# EAGLE design arduino-ss-usbmod-zif-smaller (EAGLE 7.7.0)
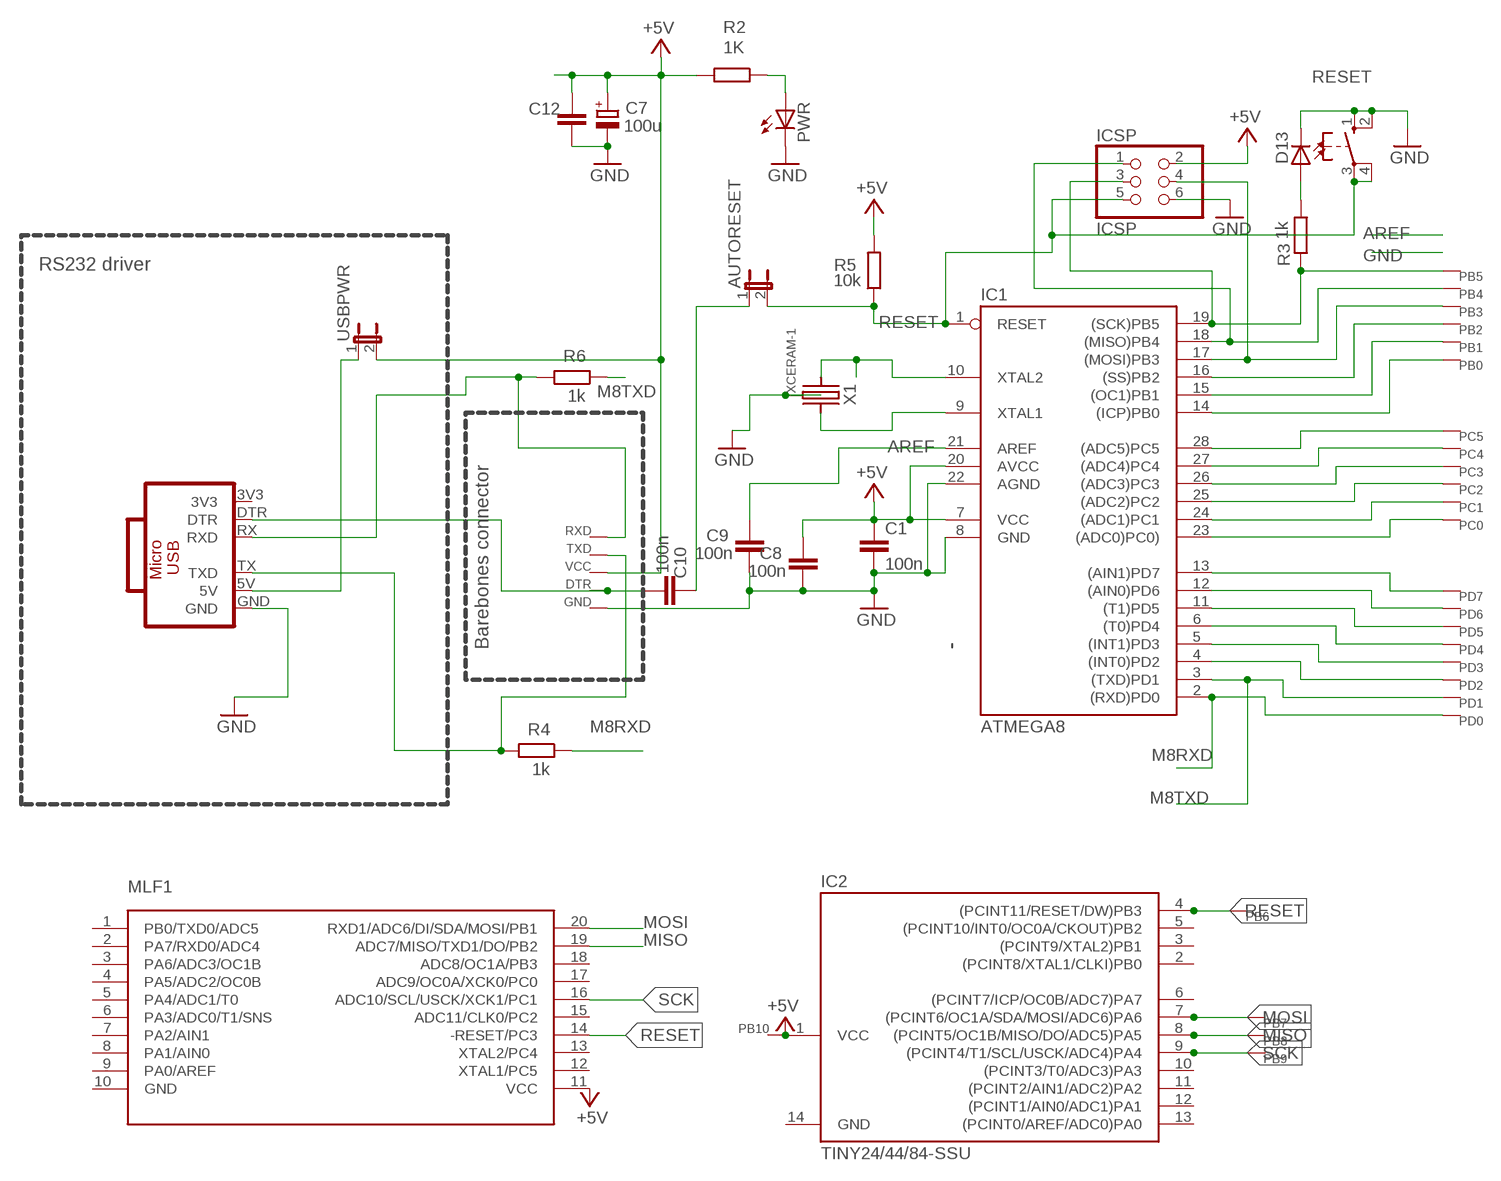
[diagram p0: schematic, sheet 1]

## Parts
AUTORESET  JUMPER-2PTH  [1X02]
C1  100n  C-EU050-025X075  [C050-025X075]
C7  100u  CPOL-EUE3.5-8  [E3,5-8]
C8  100n  C-EU050-025X075  [C050-025X075]
C9  100n  C-EU050-025X075  [C050-025X075]
C10  100n  C-EU050-025X075  [C050-025X075]
C12  100n  C-EU050-025X075  [C050-025X075]
D13  LED3MM  [LED3MM]
DTR  WIRER  [GENERIC-RD-1]
GND  WIRER  [GENERIC-RD-1]
IC1  ATMEGA8  AT90S4433ZIF  [ZIF28/3]
IC2  TINY24/44/84-SSU  [SOIC14]
ICSP  ICSP  PINHD-2X3  [2X03]
MLF1  ATTINY1634SOIC20  [SOIC20]
MOD1  CH340E-MODNOHOLES  [CH340E-MOD-NOHOLES]
PB0  WIRE-VIA11  [VIA11]
PB1  WIRE-VIA11  [VIA11]
PB2  WIRE-VIA11  [VIA11]
PB3  WIRE-VIA11  [VIA11]
PB4  WIRE-VIA11  [VIA11]
PB5  WIRE-VIA11  [VIA11]
PB6  WIRE-VIA11  [VIA11]
PB7  WIRE-VIA11  [VIA11]
PB8  WIRE-VIA11  [VIA11]
PB9  WIRE-VIA11  [VIA11]
PB10  WIRE-VIA11  [VIA11]
PC0  WIRER  [GENERIC-RD-1]
PC1  WIRE-VIA11  [VIA11]
PC2  WIRE-VIA11  [VIA11]
PC3  WIRE-VIA11  [VIA11]
PC4  WIRE-VIA11  [VIA11]
PC5  WIRE-VIA11  [VIA11]
PD0  WIRE-VIA11  [VIA11]
PD1  WIRE-VIA11  [VIA11]
PD2  WIRE-VIA11  [VIA11]
PD3  WIRE-VIA11  [VIA11]
PD4  WIRE-VIA11  [VIA11]
PD5  WIRE-VIA11  [VIA11]
PD6  WIRE-VIA11  [VIA11]
PD7  WIRE-VIA11  [VIA11]
PWR  LED3MM  [LED3MM]
R2  1K  R-EU_0207/7  [0207/7]
R3  1k  R-EU_0204/5  [0204/5]
R4  1k  R-EU_0207/7  [0207/7]
R5  10k  R-EU_0207/7  [0207/7]
R6  1k  R-EU_0207/7  [0207/7]
RESET  10-XX  [B3F-10XX]
RXD  WIRER  [GENERIC-RD-1]
TXD  WIRER  [GENERIC-RD-1]
USBPWR  JUMPER-2PTH  [1X02]
VCC  WIRE-VIA11  [VIA11]
X1  XCERAM-1  [XTAL-3]

## Nets
+5V [power]: C1.1 C7.+ C8.2 C12.2 IC1.7(VCC) IC1.20(AVCC) IC2.1(VCC) ICSP.2 MLF1.11(VCC) PB10.P$1 R2.2 R5.2 USBPWR.2 VCC.P$1
AREF: C9.2 IC1.21(AREF)
DTR: C10.1 DTR.P$1 MOD1.DTR
GND [power]: C1.2 C7.- C8.1 C9.1 C12.1 D13.K(C) GND.P$1 IC1.8(GND) IC1.22(AGND) ICSP.6 MOD1.GND PWR.K(C) RESET.1(S) RESET.2(S1) X1.P$2(GND)
M8RXD: IC1.2((RXD)PD0) PD0.P$1 R4.1
M8TXD: IC1.3((TXD)PD1) PD1.P$1 R6.1
MISO: IC1.18((MISO)PB4) IC2.8((PCINT5/OC1B/MISO/DO/ADC5)PA5) ICSP.1 MLF1.19(ADC7/MISO/TXD1/DO/PB2) PB4.P$1 PB8.P$1
MOSI: IC1.17((MOSI)PB3) IC2.7((PCINT6/OC1A/SDA/MOSI/ADC6)PA6) ICSP.4 MLF1.20(RXD1/ADC6/DI/SDA/MOSI/PB1) PB3.P$1 PB7.P$1
N$1: D13.A R3.1
N$2 [power]: MOD1.5V USBPWR.1
N$3: PWR.A R2.1
N$4: AUTORESET.1 C10.2
N$5: IC1.14((ICP)PB0) PB0.P$1
N$6: IC1.9(XTAL1) X1.P$3
N$7: IC1.10(XTAL2) X1.P$1
N$10: IC1.4((INT0)PD2) PD2.P$1
N$11: IC1.5((INT1)PD3) PD3.P$1
N$12: IC1.6((T0)PD4) PD4.P$1
N$13: IC1.11((T1)PD5) PD5.P$1
N$14: IC1.12((AIN0)PD6) PD6.P$1
N$15: IC1.13((AIN1)PD7) PD7.P$1
N$16: IC1.23((ADC0)PC0)) PC0.P$1
N$17: IC1.24((ADC1)PC1) PC1.P$1
N$18: IC1.25((ADC2)PC2) PC2.P$1
N$19: IC1.26((ADC3)PC3) PC3.P$1
N$20: IC1.27((ADC4)PC4) PC4.P$1
N$21: IC1.28((ADC5)PC5) PC5.P$1
N$22: IC1.15((OC1)PB1) PB1.P$1
N$26: MOD1.TX(TXD) R4.2 TXD.P$1
N$27: MOD1.RX(RXD) R6.2 RXD.P$1
RESET: AUTORESET.2 IC1.1(RESET) IC2.4((PCINT11/RESET/DW)PB3) ICSP.5 MLF1.14(-RESET/PC3) PB6.P$1 R5.1 RESET.3(P) RESET.4(P1)
SCK: IC1.19((SCK)PB5) IC2.9((PCINT4/T1/SCL/USCK/ADC4)PA4) ICSP.3 MLF1.16(ADC10/SCL/USCK/XCK1/PC1) PB5.P$1 PB9.P$1 R3.2
SS: IC1.16((SS)PB2) PB2.P$1
Unconnected: IC2.2((PCINT8/XTAL1/CLKI)PB0) IC2.3((PCINT9/XTAL2)PB1) IC2.5((PCINT10/INT0/OC0A/CKOUT)PB2) IC2.6((PCINT7/ICP/OC0B/ADC7)PA7) IC2.10((PCINT3/T0/ADC3)PA3) IC2.11((PCINT2/AIN1/ADC2)PA2) IC2.12((PCINT1/AIN0/ADC1)PA1) IC2.13((PCINT0/AREF/ADC0)PA0) MLF1.1(PB0/TXD0/ADC5) MLF1.2(PA7/RXD0/ADC4) MLF1.3(PA6/ADC3/OC1B) MLF1.4(PA5/ADC2/OC0B) MLF1.5(PA4/ADC1/T0) MLF1.6(PA3/ADC0/T1/SNS) MLF1.7(PA2/AIN1) MLF1.8(PA1/AIN0) MLF1.9(PA0/AREF) MLF1.12(XTAL1/PC5) MLF1.13(XTAL2/PC4) MLF1.15(ADC11/CLK0/PC2) MLF1.17(ADC9/OC0A/XCK0/PC0) MLF1.18(ADC8/OC1A/PB3)

## Notes on the sheet
- RS232 driver
- Barebones connector

## Power pins joined to a net without a drawn wire
3V3: MOD1.3V3
GND: IC2.14(GND) MLF1.10(GND)

## Library data of the parts
AUTORESET USBPWR = SparkFun:JUMPER-2: Jumper Basic 0.1" spaced jumper. Use with breakaway headers.
C1 C8-C10 C12 = my-rcl:C-EU: CAPACITOR, European symbol
C7 = my-rcl:CPOL-EU: POLARIZED CAPACITOR, European symbol
D13 PWR = led:LED: LED OSRAM: - CHIPLED LG R971, LG N971, LY N971, LG Q971, LY Q971, LO R971, LY R971 LH N974, LH R974 LS Q976, LO Q976, LY Q976 LO Q996 - Hyper CHIPLED LW Q18S LB Q993, LB Q99A, LB R99A - SideLED LS A670, LO A670, LY A670, LG A670, LP A670 LB A673, LV A673, LT A673, LW A673 LH A674 LY A675 LS A676, LA A676, LO A676, LY A676, LW A676 LS A679, LY A679, LG A679 - Hyper Micro SIDELED® LS Y876, LA Y876, LO Y876, LY Y876 LT Y87S - SmartLED LW L88C, LW L88S LB L89C, LB L89S, LG L890 LS L89K, LO L89K, LY L89K LS L896, LA L896, LO L896, LY L896 - TOPLED LS T670, LO T670, LY T670, LG T670, LP T670 LSG T670, LSP T670, LSY T670, LOP T670, LYG T670 LG T671, LOG T671, LSG T671 LB T673, LV T673, LT T673, LW T673 LH T674 LS T676, LA T676, LO T676, LY T676, LB T676, LH T676, LSB T676, LW T676 LB T67C, LV T67C, LT T67C, LS T67K, LO T67K, LY T67K, LW E67C LS E67B, LA E67B, LO E67B, LY E67B, LB E67C, LV E67C, LT E67C LW T67C LS T679, LY T679, LG T679 LS T770, LO T770, LY T770, LG T770, LP T770 LB T773, LV T773, LT T773, LW T773 LH T774 LS E675, LA E675, LY E675, LS T675 LS T776, LA T776, LO T776, LY T776, LB T776 LHGB T686 LT T68C, LB T68C - Hyper Mini TOPLED® LB M676 - Mini TOPLED Santana® LG M470 LS M47K, LO M47K, LY M47K Source: http://www.osram.convergy.de/
DTR GND PB0 PB1-PB10 PC0 PC1-PC5 PD0 PD1-PD7 RXD TXD VCC = mylib4:WIRE: Pad for a wire offboard
IC1 = atmel:AT90S4433: MICROCONTROLLER 4 Kbytes FLASH 128 bytes SRAM 256 bytes EEPROM UART 6-channel 10 bit ADC
IC2 = avr-7:TINY24/44/84
ICSP = pinhead:PINHD-2X3: PIN HEADER
MLF1 = attiny1634:ATTINY1634
MOD1 = mini-usb:CH340E-MOD
R2-R6 = my-rcl:R-EU_: RESISTOR, European symbol
RESET = switch-omron:10-XX: OMRON SWITCH
X1 = mylib4:XCERAM: Ceramic resonator with built-in caps

## Net classes
0 default: width 0.5 mm
1 power: width 0.6 mm

## Board
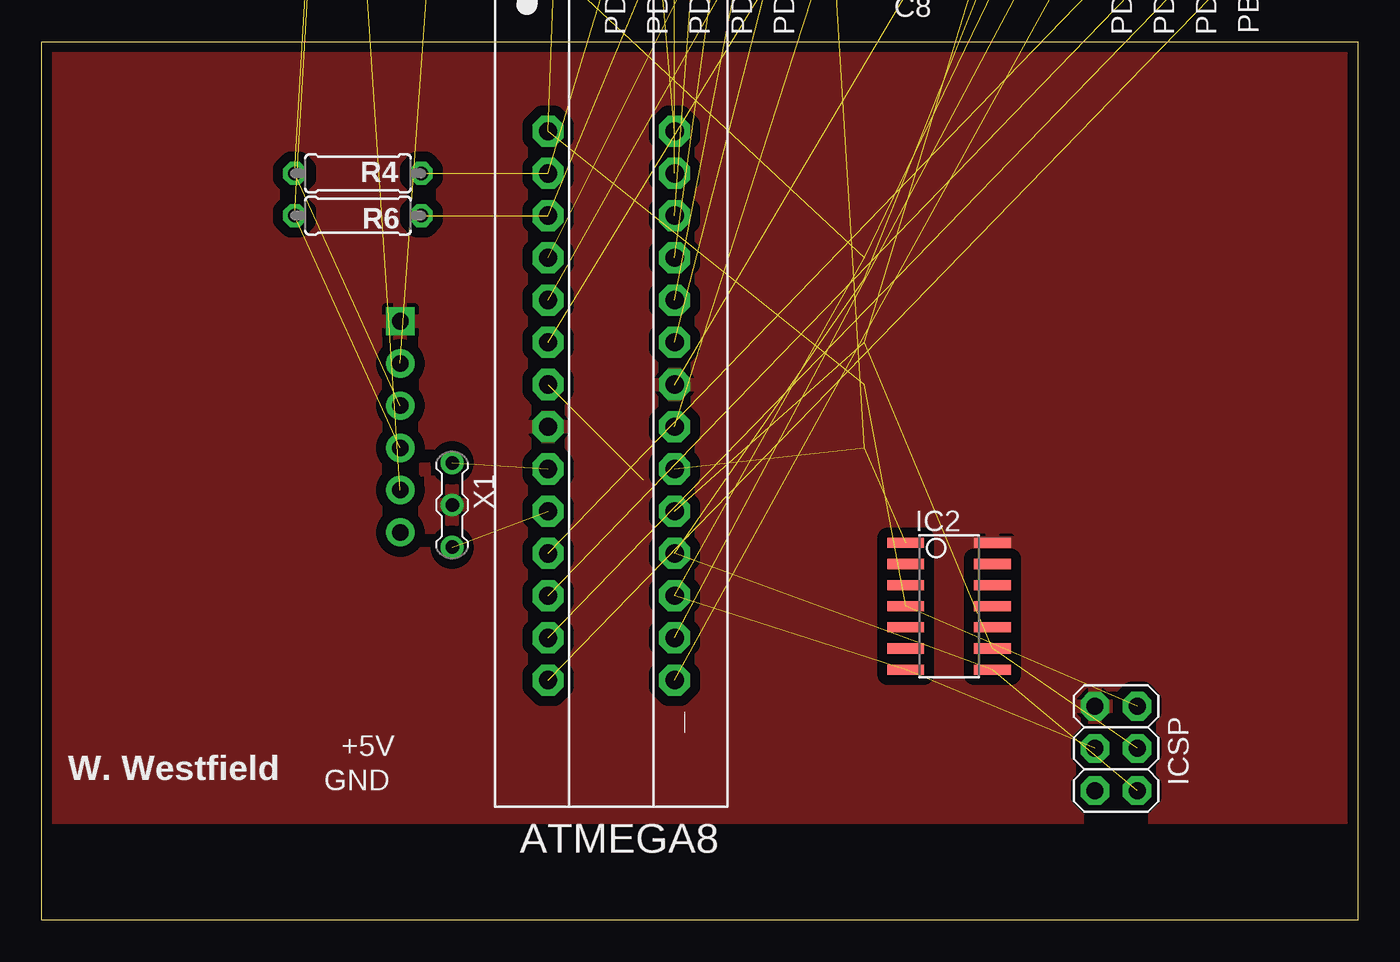
[diagram p1: board, top side]
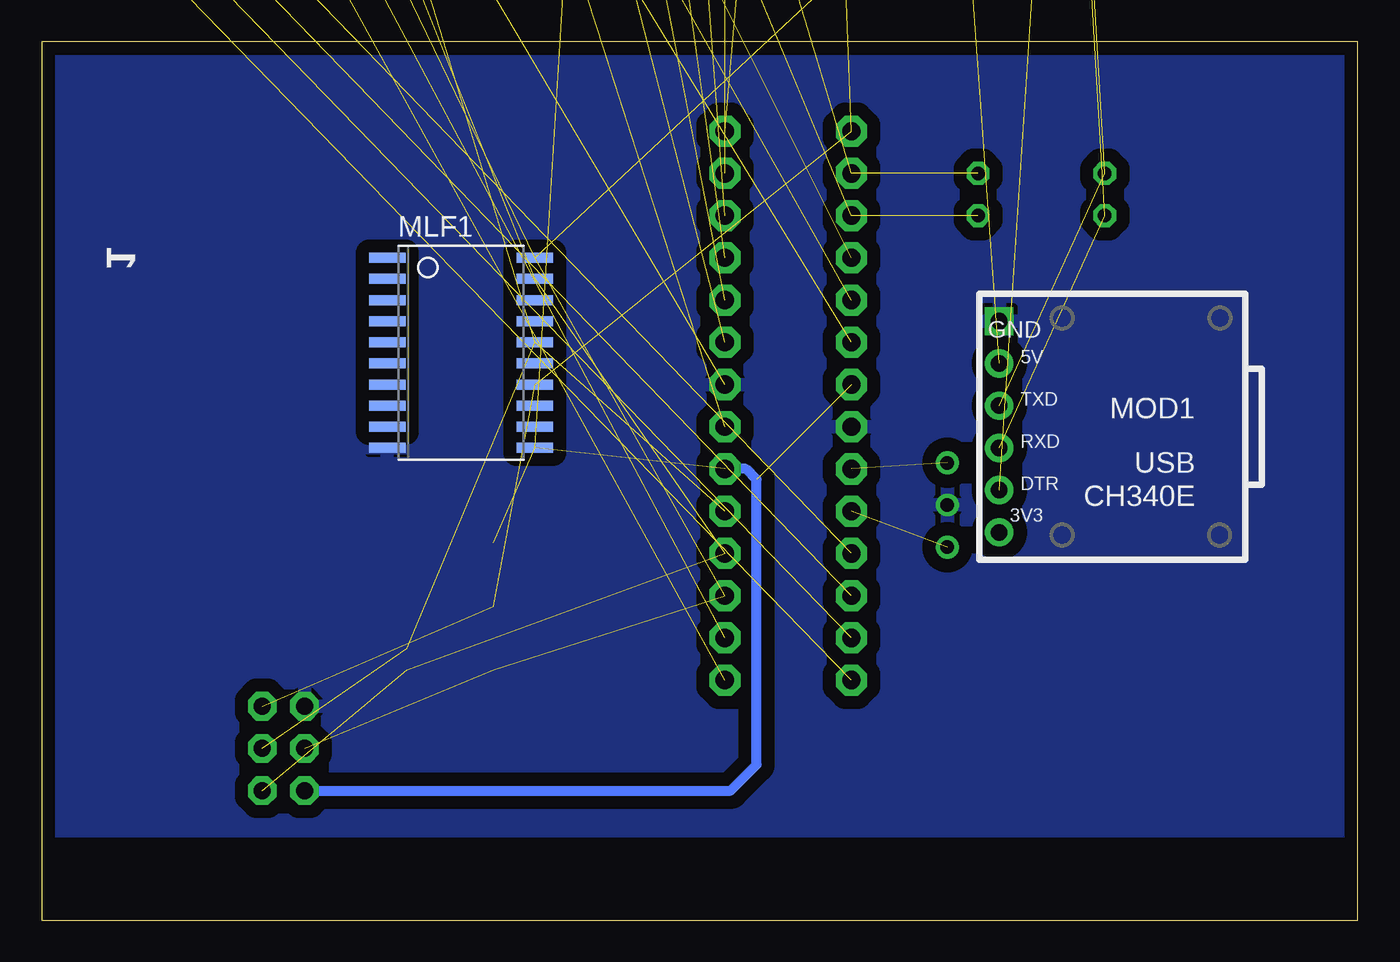
[diagram p2: board, bottom side, seen from below]

Size 79.21 x 52.86 mm. Coordinates in mm from the lower left corner, seen from the top.
Outline: 0,0 0,52.86 79.21,52.86 79.21,0 0,0
Copper layers (1*16): Top 0.035mm / dielectric 1.5mm / Bottom 0.035mm
Design rules "default *": minimum track width 10mil, minimum drill 0.8mm, track to track 0.35mm, track to pad 0.35mm, pad to pad 0.35mm, via to via 8mil, smd to smd 8mil, copper to edge 20mil, drill to drill 8mil, minimum pad ring 5mil, minimum via ring 8mil, stop-mask expansion 4mil, vias tented up to drill 0mil, thermal gap 10mil

### Footprints (pad centres in the part's own frame; a part is rotated, then mirrored left to right if it is on the bottom)
1X02 = drill 1.016: 1 0,0; 2 2.54,0
C050-025X075 = drill 0.813 octagon: 1 -2.54,0; 2 2.54,0
E3,5-8 = drill 0.813 pad 1.6: + -1.778,0 | drill 0.813 pad 1.6 octagon: - 1.778,0
LED3MM = drill 0.813 octagon: A -1.27,0; K 1.27,0
GENERIC-RD-1 = drill 0.813: P$1 0,0
ZIF28/3 = drill 1.1 pad 1.6 octagon: 1 -16.51,-3.81; 2 -13.97,-3.81; 3 -11.43,-3.81; 4 -8.89,-3.81; 5 -6.35,-3.81; 6 -3.81,-3.81; 7 -1.27,-3.81; 8 1.27,-3.81; 9 3.81,-3.81; 10 6.35,-3.81; 11 8.89,-3.81; 12 11.43,-3.81; 13 13.97,-3.81; 14 16.51,-3.81; 15 16.51,3.81; 16 13.97,3.81; 17 11.43,3.81; 18 8.89,3.81; 19 6.35,3.81; 20 3.81,3.81; 21 1.27,3.81; 22 -1.27,3.81; 23 -3.81,3.81; 24 -6.35,3.81; 25 -8.89,3.81; 26 -11.43,3.81; 27 -13.97,3.81; 28 -16.51,3.81
SOIC14 = smd 0.61 x 2.21: 1 -3.81,-2.603; 2 -2.54,-2.603; 3 -1.27,-2.603; 4 0,-2.603; 5 1.27,-2.603; 6 2.54,-2.603; 7 3.81,-2.603; 8 3.81,2.603; 9 2.54,2.603; 10 1.27,2.603; 11 0,2.603; 12 -1.27,2.603; 13 -2.54,2.603; 14 -3.81,2.603
2X03 = drill 1.016 octagon: 1 -2.54,-1.27; 2 -2.54,1.27; 3 0,-1.27; 4 0,1.27; 5 2.54,-1.27; 6 2.54,1.27
SOIC20 = smd 0.6 x 2.2: 1 -1.905,-4.445; 2 -0.635,-4.445; 3 0.635,-4.445; 4 1.905,-4.445; 5 3.175,-4.445; 6 4.445,-4.445; 7 5.715,-4.445; 8 6.985,-4.445; 9 8.255,-4.445; 10 9.525,-4.445; 11 9.525,4.445; 12 8.255,4.445; 13 6.985,4.445; 14 5.715,4.445; 15 4.445,4.445; 16 3.175,4.445; 17 1.905,4.445; 18 0.635,4.445; 19 -0.635,4.445; 20 -1.905,4.445
CH340E-MOD-NOHOLES = drill 1: 3V3 6.35,6.35; 5V 6.35,-3.81; DTR 6.35,3.81; RX 6.35,1.27; TX 6.35,-1.27 | drill 1 square: GND 6.35,-6.35
VIA11 = drill 1.1: P$1 0,0
0207/7 = drill 0.813 octagon: 1 -3.81,0; 2 3.81,0
0204/5 = drill 0.813 octagon: 1 -2.54,0; 2 2.54,0
B3F-10XX = drill 1.016 long: 1 -3.251,2.261; 2 3.251,2.261; 3 -3.251,-2.261; 4 3.251,-2.261
XTAL-3 = drill 0.813: P$1 0,2.54; P$2 0,0; P$3 0,-2.54

### Placement (x,y rotation side)
AUTORESET  29.07,77.14 0 top  (outside the outline)
C1  50.96,80.62 180 top  (outside the outline)
C7  41.55,89.23 270 top  (outside the outline)
C8  50.27,57.09 180 top  (outside the outline)
C9  50.84,77.44 0 top  (outside the outline)
C10  31.74,83.1 270 top  (outside the outline)
C12  35.83,91.14 90 top  (outside the outline)
D13  62.87,81.97 0 top  (outside the outline)
DTR  17.77,83.03 180 top  (outside the outline)
GND  17.77,93.19 180 top  (outside the outline)
IC1  34.28,30.96 270 top
IC2  54.6,18.89 270 top
ICSP  64.66,10.34 90 top
MLF1  53.97,37.94 270 bottom
MOD1  15.23,29.69 180 bottom
PB0  72.38,57.63 270 top  (outside the outline)
PB1  72.38,76.68 90 top  (outside the outline)
PB2  69.84,76.68 90 top  (outside the outline)
PB3  67.3,76.68 90 top  (outside the outline)
PB4  64.76,76.68 90 top  (outside the outline)
PB5  62.22,76.68 90 top  (outside the outline)
PB6  9.52,74.77 0 top  (outside the outline)
PB7  12.06,74.77 0 top  (outside the outline)
PB8  14.6,74.77 0 top  (outside the outline)
PB9  17.14,74.77 0 top  (outside the outline)
PB10  19.68,74.77 0 top  (outside the outline)
PC0  48.25,74.14 0 top  (outside the outline)
PC1  45.71,76.68 0 top  (outside the outline)
PC2  43.17,76.68 90 top  (outside the outline)
PC3  40.63,76.68 90 top  (outside the outline)
PC4  38.09,76.68 90 top  (outside the outline)
PC5  35.55,76.68 90 top  (outside the outline)
PD0  34.28,57.63 270 top  (outside the outline)
PD1  36.82,57.63 270 top  (outside the outline)
PD2  39.36,57.63 270 top  (outside the outline)
PD3  41.9,57.63 270 top  (outside the outline)
PD4  44.44,57.63 270 top  (outside the outline)
PD5  64.76,57.63 270 top  (outside the outline)
PD6  67.3,57.63 270 top  (outside the outline)
PD7  69.84,57.63 270 top  (outside the outline)
PWR  41.18,82.7 180 top  (outside the outline)
R2  49.2,89.49 90 top  (outside the outline)
R3  58.48,80.21 270 top  (outside the outline)
R4  19.04,44.93 180 top
R5  69.07,89.14 270 top  (outside the outline)
R6  19.04,42.39 180 top
RESET  57.56,89.19 180 top  (outside the outline)
RXD  17.77,85.57 180 top  (outside the outline)
TXD  17.77,88.11 180 top  (outside the outline)
USBPWR  25.87,93.42 0 top  (outside the outline)
VCC  31.07,93.74 0 top  (outside the outline)
X1  24.7,24.98 180 top

### Tracks (layer width: path | path; a pad name or v marks a point on that pad's centre or on a via)
+5V  (12 unrouted)
  Bottom 0.6: ICSP.2 37.75,7.8 36.19,9.37 36.19,26.51 36.82,27.15 IC1.20
AREF  (1 unrouted)
DTR  (2 unrouted)
GND  (10 unrouted)
  pour Bottom (isolate 0.8, rank 6): -3.18,54.33 80.8,54.33 80.8,5.4 -3.18,5.4
  pour Top (isolate 0.61): -1.28,54.45 -1.28,6.19 81.27,6.19 81.27,54.45
M8RXD  (2 unrouted)
M8TXD  (2 unrouted)
MISO  (5 unrouted)
MOSI  (5 unrouted)
N$1  (1 unrouted)
N$2  (1 unrouted)
N$3  (1 unrouted)
N$4  (1 unrouted)
N$5  (1 unrouted)
N$6  (1 unrouted)
N$7  (1 unrouted)
N$9  (via drill 1.2)
  other vias: 7.64,93.36
N$10  (1 unrouted)
N$11  (1 unrouted)
N$12  (1 unrouted)
N$13  (1 unrouted)
N$14  (1 unrouted)
N$15  (1 unrouted)
N$16  (1 unrouted)
N$17  (1 unrouted)
N$18  (1 unrouted)
N$19  (1 unrouted)
N$20  (1 unrouted)
N$21  (1 unrouted)
N$22  (1 unrouted)
N$23  (via drill 1.2)
  other vias: 7.67,80.35
N$26  (2 unrouted)
N$27  (2 unrouted)
RESET  (8 unrouted)
SCK  (6 unrouted)
SS  (1 unrouted)

### Text on the board
bPlace: 1
tNames: +5V | W. Westfield | GND
_tSilk: USBPWR | GND | RESET | 100u | 10k | C7 | 1K | MOD1 | TXD | 100n | R5 | ICSP | USB | RXD | 1k | 100n | 1k | DTR | PWR | D13 | 100n | 1k | CH340E | PC5 | PC4 | PC3 | PC2 | PC1 | PB5 | PB4 | PB3 | PB2 | PB1 | AUTORESET | PC0 | IC1 | ATMEGA8 | X1 | PD0 | PD1 | PD2 | PD3 | PD4 | PD5 | PD6 | PD7 | PB0 | 100n | W. Westfield | +5V | GND
_bplace: 5V | TXD | RXD | 1 | DTR | 3V3